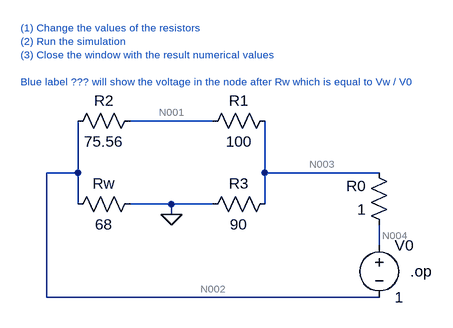
[diagram p0: schematic Wheatstone_Calculator_Vw_V0.asc]
Wheatstone_Calculator_Vw_V0.asc, the LTspice schematic file:
Version 4
SHEET 1 880 700
WIRE -720 -400 -848 -400
WIRE -928 -320 -928 -400
WIRE -928 -320 -976 -320
WIRE -640 -320 -640 -400
WIRE -464 -320 -640 -320
WIRE -928 -272 -928 -320
WIRE -784 -272 -848 -272
WIRE -720 -272 -784 -272
WIRE -640 -272 -640 -320
WIRE -784 -256 -784 -272
WIRE -464 -208 -464 -240
WIRE -976 -128 -976 -320
WIRE -464 -128 -976 -128
FLAG -784 -256 0
DATAFLAG -928 -288 ""
SYMBOL voltage -464 -224 R0
WINDOW 123 0 0 Left 0
WINDOW 39 24 124 Left 2
SYMATTR InstName V0
SYMATTR Value 1
SYMBOL res -832 -288 R90
WINDOW 0 0 56 VBottom 2
WINDOW 3 32 56 VTop 2
SYMATTR InstName Rw
SYMATTR Value 68
SYMBOL res -832 -416 R90
WINDOW 0 0 56 VBottom 2
WINDOW 3 32 56 VTop 2
SYMATTR InstName R2
SYMATTR Value 75.56
SYMBOL res -624 -416 R90
WINDOW 0 0 56 VBottom 2
WINDOW 3 32 56 VTop 2
SYMATTR InstName R1
SYMATTR Value 100
SYMBOL res -448 -224 R180
WINDOW 0 36 76 Left 2
WINDOW 3 36 40 Left 2
SYMATTR InstName R0
SYMATTR Value 1
SYMBOL res -624 -288 R90
WINDOW 0 0 56 VBottom 2
WINDOW 3 32 56 VTop 2
SYMATTR InstName R3
SYMATTR Value 90
TEXT -416 -168 Left 2 !.op
TEXT -1016 -544 Left 1 ;(1) Change the values of the resistors\n(2) Run the simulation\n(3) Close the window with the result numerical values\n \nBlue label ??? will show the voltage in the node after Rw which is equal to Vw / V0

The netlist it stands for:
* Wheatstone_Calculator_Vw_V0.asc
V0 N004 N002 1
Rw 0 N002 68
R2 N001 N002 75.56
R1 N003 N001 100
R0 N004 N003 1
R3 N003 0 90
.op
* (1) Change the values of the resistors
* (2) Run the simulation
* (3) Close the window with the result numerical values
* Blue label ??? will show the voltage in the node after Rw which is equal to Vw / V0
.backanno
.end

* Results of the author's LTspice run, read from the files saved beside the schematic
* Operating Point:
*   V(n004) = 574.7 mV
*   V(n002) = -425.3 mV
*   V(n001) = 14.25 µV
*   V(n003) = 562.9 mV
*   I(R3) = 6.254 mA
*   I(R0) = 11.88 mA
*   I(R1) = 5.628 mA
*   I(R2) = 5.628 mA
*   I(Rw) = 6.254 mA
*   I(V0) = -11.88 mA